# EAGLE design VerdiRT7_Sensor (EAGLE 8.5.2)
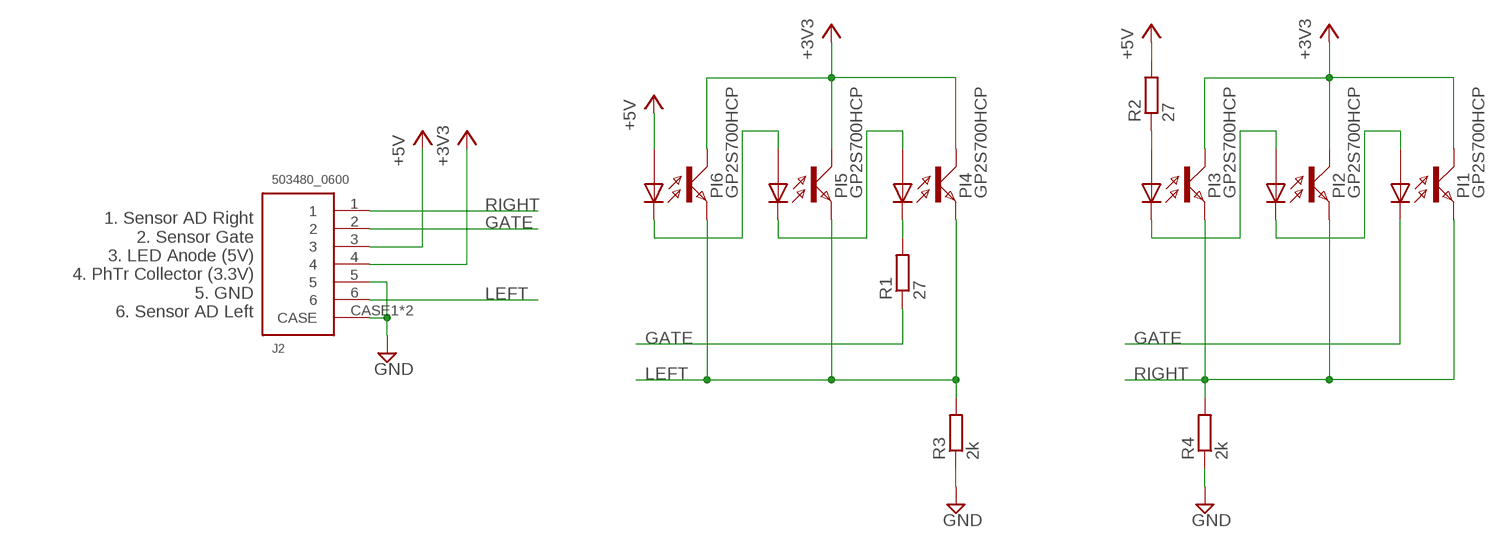
[diagram p0: schematic, sheet 1]

## Parts
J2  503480_0600  [0600]
PI1  GP2S700HCP  [GP2S700]
PI2  GP2S700HCP  [GP2S700]
PI3  GP2S700HCP  [GP2S700]
PI4  GP2S700HCP  [GP2S700]
PI5  GP2S700HCP  [GP2S700]
PI6  GP2S700HCP  [GP2S700]
R1  27  R-EU_R0603  [R0603]
R2  27  R-EU_R0603  [R0603]
R3  2k  R-EU_R0603  [R0603]
R4  2k  R-EU_R0603  [R0603]

## Nets
+3V3: J2.4 PI1.COLLECTOR PI2.COLLECTOR PI3.COLLECTOR PI4.COLLECTOR PI5.COLLECTOR PI6.COLLECTOR
+5V: J2.3 PI6.ANODE R2.2
GATE: J2.2 PI1.CATHODE R1.1
GND: J2.5 J2.CASE1(CASE) J2.CASE2(CASE) R3.1 R4.1
LEFT: J2.6 PI4.EMITTER PI5.EMITTER PI6.EMITTER R3.2
N$1: PI5.ANODE PI6.CATHODE
N$2: PI4.ANODE PI5.CATHODE
N$3: PI4.CATHODE R1.2
N$4: PI2.ANODE PI3.CATHODE
N$5: PI1.ANODE PI2.CATHODE
N$6: PI3.ANODE R2.1
RIGHT: J2.1 PI1.EMITTER PI2.EMITTER PI3.EMITTER R4.2

## Notes on the sheet
- 1. Sensor AD Right
  2. Sensor Gate
  3. LED Anode (5V)
  4. PhTr Collector (3.3V)
  5. GND
  6. Sensor AD Left

## Library data of the parts
J2 = molex_503480:503480_0600
PI1-PI6 = Photo_Interrupter:GP2S700HCP; HEIGHT: 2
R1-R4 = rcl:R-EU_: RESISTOR, European symbol

## Board
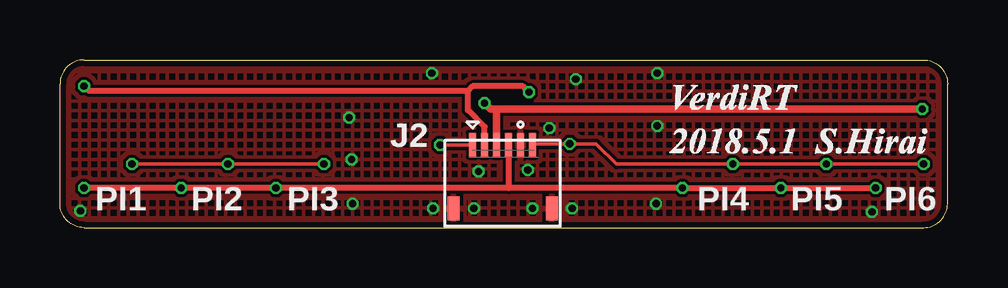
[diagram p1: board, top side]
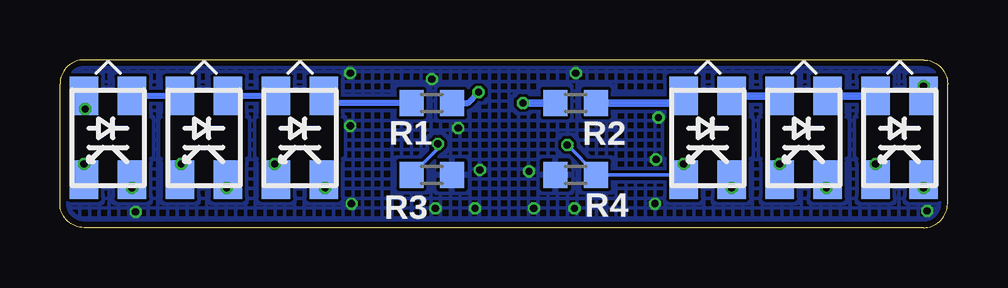
[diagram p2: board, bottom side, seen from below]

Size 37 x 7 mm. Coordinates in mm from the lower left corner, seen from the top.
Outline: 1,7 36,7 arc-90 37,6 37,1 arc-90 36,0 1,0 arc-90 0,1 0,6 arc-90 1,7
Copper layers (1*16): Top 0.035mm / dielectric 1.5mm / Bottom 0.035mm
Design rules "PCBgogo_5mil_drill_0_2mm_t0_4": minimum track width 5mil, minimum drill 0.2mm, track to track 5mil, track to pad 5mil, pad to pad 5mil, via to via 0.15mm, smd to smd 0mil, copper to edge 10mil, drill to drill 0.2mm, minimum pad ring 6mil, minimum via ring 0.1mm, stop-mask expansion 3mil, vias tented up to drill 0mil, thermal gap 6mil

### Footprints (pad centres in the part's own frame; a part is rotated, then mirrored left to right if it is on the bottom)
0600 = smd 0.3 x 1: 1 -1.25,1.6; 2 -0.75,1.6; 3 -0.25,1.6; 4 0.25,1.6; 5 0.75,1.6; 6 1.25,1.6 | smd 0.5 x 1: CASE1 -2.05,-1.05; CASE2 2.05,-1.05
GP2S700 = smd 1.6 x 1.2: ANODE 1.75,1; CATHODE 1.75,-1; COLLECTOR -1.75,-1; EMITTER -1.75,1
R0603 = smd 1 x 1.1: 1 -0.85,0; 2 0.85,0

### Placement (x,y rotation side)
J2  18.45,1.85 0 top
PI1  2,3.75 90 bottom
PI2  6,3.75 90 bottom
PI3  10,3.75 90 bottom
PI4  27,3.75 90 bottom
PI5  31,3.75 90 bottom
PI6  35,3.75 90 bottom
R1  21.5,5.2 180 bottom
R2  15.5,5.2 180 bottom
R3  21.5,2.2 180 bottom
R4  15.5,2.2 0 bottom

### Tracks (layer width: path | path; a pad name or v marks a point on that pad's centre or on a via)
+3V3  (via drill 0.3)
  Top 0.254: v1,1.65 v5.05,1.65 v9,1.65 18.7,1.65 | v34,1.65 v30.05,1.65 v25.95,1.65 18.7,1.65 | J2.4 18.7,1.65
  Bottom 0.152: v34,1.65 PI6.COLLECTOR | PI5.COLLECTOR 30,1.7 v30.05,1.65 | PI4.COLLECTOR 26,1.7 v25.95,1.65 | v1,1.65 PI1.COLLECTOR | PI2.COLLECTOR 5,1.7 v5.05,1.65 | v9,1.65 PI3.COLLECTOR
+5V  (via drill 0.3)
  Top 0.305: 18.2,4.95 17.95,4.95 v17.7,5.2 | 18.2,4.95 v35.95,4.95 | J2.3 18.2,4.95
  Bottom 0.305: v17.7,5.2 R2.2 | PI6.ANODE 36,5 v35.95,4.95
GATE  (via drill 0.3)
  Top 0.254: J2.2 17.7,4.2 17,4.9 17,5.7 | v19.55,5.65 19.3,5.9 17.2,5.9 17,5.7 | 17,5.7 1.2,5.7 v1,5.9
  Bottom 0.152: v1,5.9 PI1.CATHODE
  Bottom 0.254: R1.1 20,5.2 v19.55,5.65
GND  (via drill 0.3)
  other vias: 33.85,0.65 24.9,6.45 0.85,0.7 21.35,0.8 17.45,2.35 19.7,0.8 12.05,4.6 20.4,4.15 21.5,6.2 24.9,4.25 24.85,1 19.5,2.4 15.55,0.8 15.5,6.45 12.2,1 12.15,2.85 17.25,0.8
  pour Bottom (hatched): 38,7.7 -1,7.7 -1,-0.8 38,-0.8
  pour Top (hatched): 38,7.7 38,-0.8 -1,-0.8 -1,7.7
LEFT  (via drill 0.3)
  Top 0.152: v36,2.65 v31.95,2.65 v28.05,2.65 23.2,2.65 22.35,3.5 v21.25,3.5 19.75,3.5 J2.6
  Bottom 0.152: v36,2.65 PI6.EMITTER | PI5.EMITTER 32,2.6 v31.95,2.65 | PI4.EMITTER 28,2.6 v28.05,2.65 | R3.2 21.25,3.3 v21.25,3.5
N$1
  Bottom 0.254: PI5.ANODE PI6.CATHODE
N$2
  Bottom 0.254: PI4.ANODE PI5.CATHODE
N$3
  Bottom 0.254: R1.2 25.83,5.2
  Bottom 0.305: 25.83,5.2 PI4.CATHODE
N$4
  Bottom 0.305: PI2.ANODE PI3.CATHODE
N$5
  Bottom 0.305: PI1.ANODE PI2.CATHODE
N$6
  Bottom 0.305: R2.1 11.17,5.2 PI3.ANODE
RIGHT  (via drill 0.3)
  Top 0.152: v11,2.65 v7,2.65 v3,2.65 | v15.85,3.45 J2.1
  Bottom 0.152: v3,2.65 PI1.EMITTER | PI3.EMITTER v11,2.65 11.45,2.2 R4.2 14.65,2.25 v15.85,3.45 | PI2.EMITTER 6.97,2.65 v7,2.65